# EasyEDA Pro project sch.epro

# Schematic ESCSTRACk

## Sheets
1 Gate_driver: Board Name: Board1; Create Date: 2026-04-11; Page Name: Gate_driver; Project Name: ESC_STACK; Schematic Name: Schematic1; Update Date: 2026-04-11; Company: EasyEDA.com; Page Size: A4; Version: V1.0
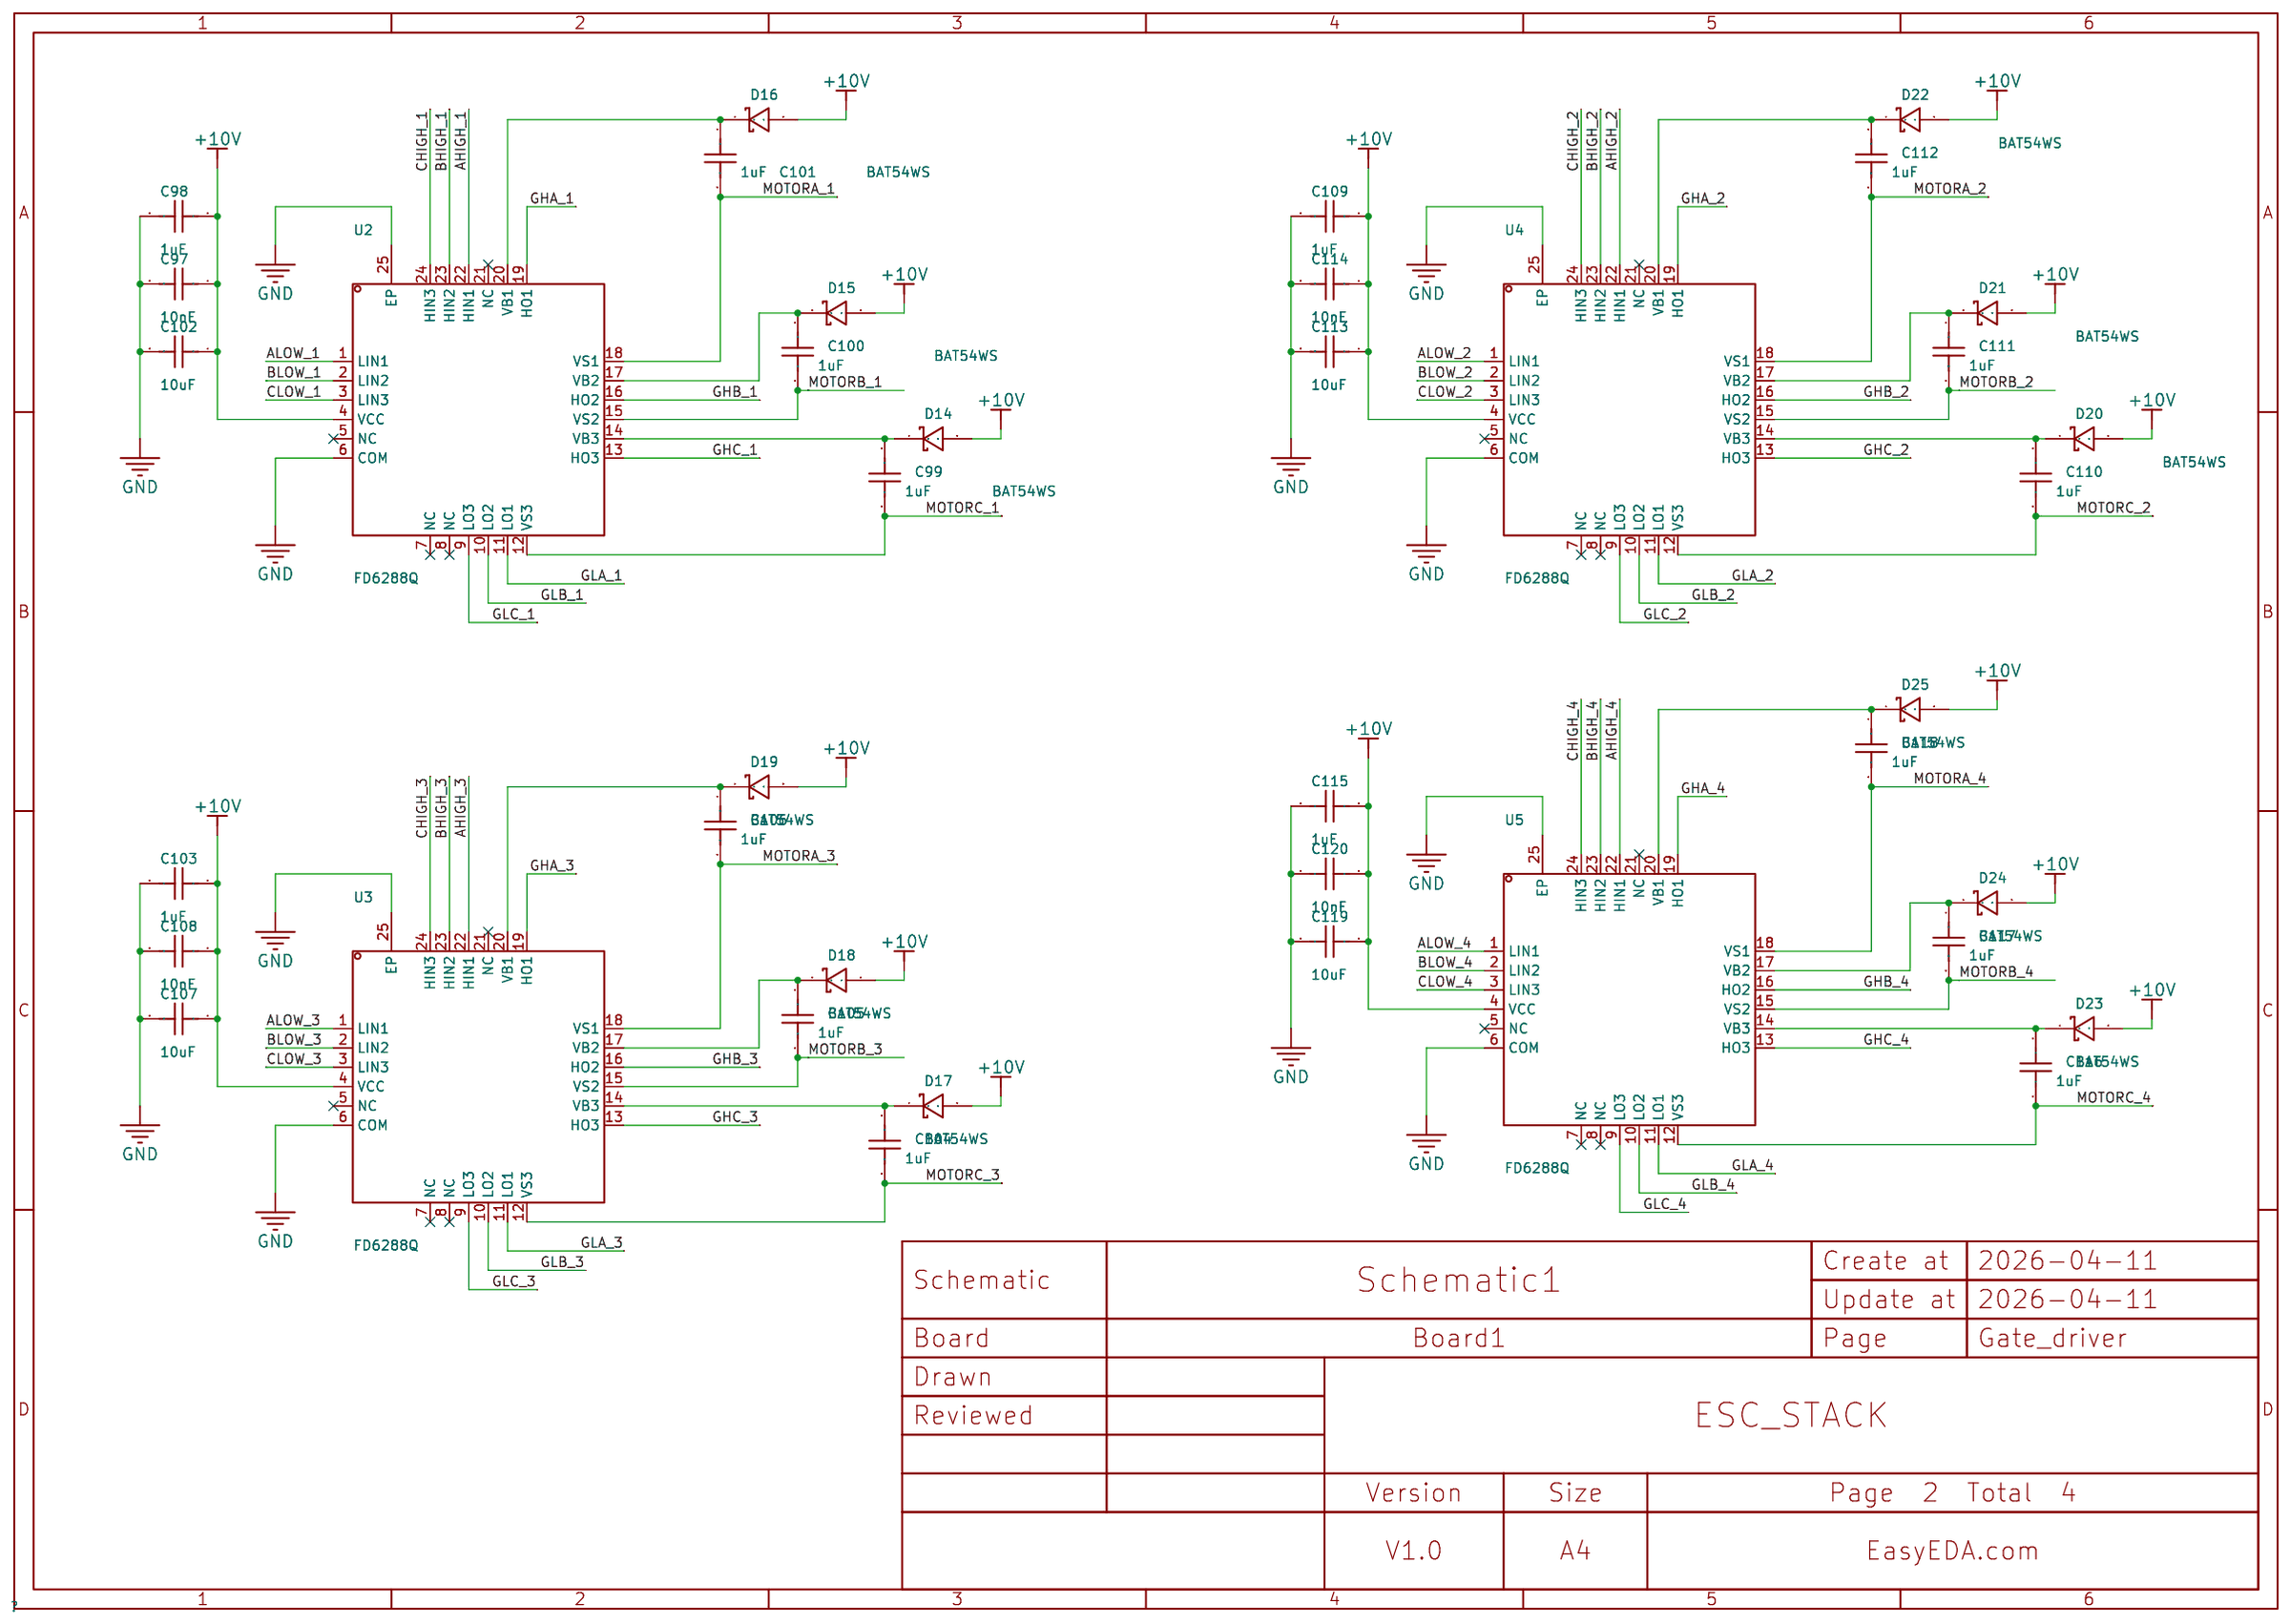
[diagram p0: Gate_driver]
2 MOSFETS: Board Name: ESCSTRACk; Create Date: 2026-05-31; Page Name: MOSFETS; Project Name: ADV_FC; Schematic Name: ESCSTRACk; Update Date: 2026-05-31
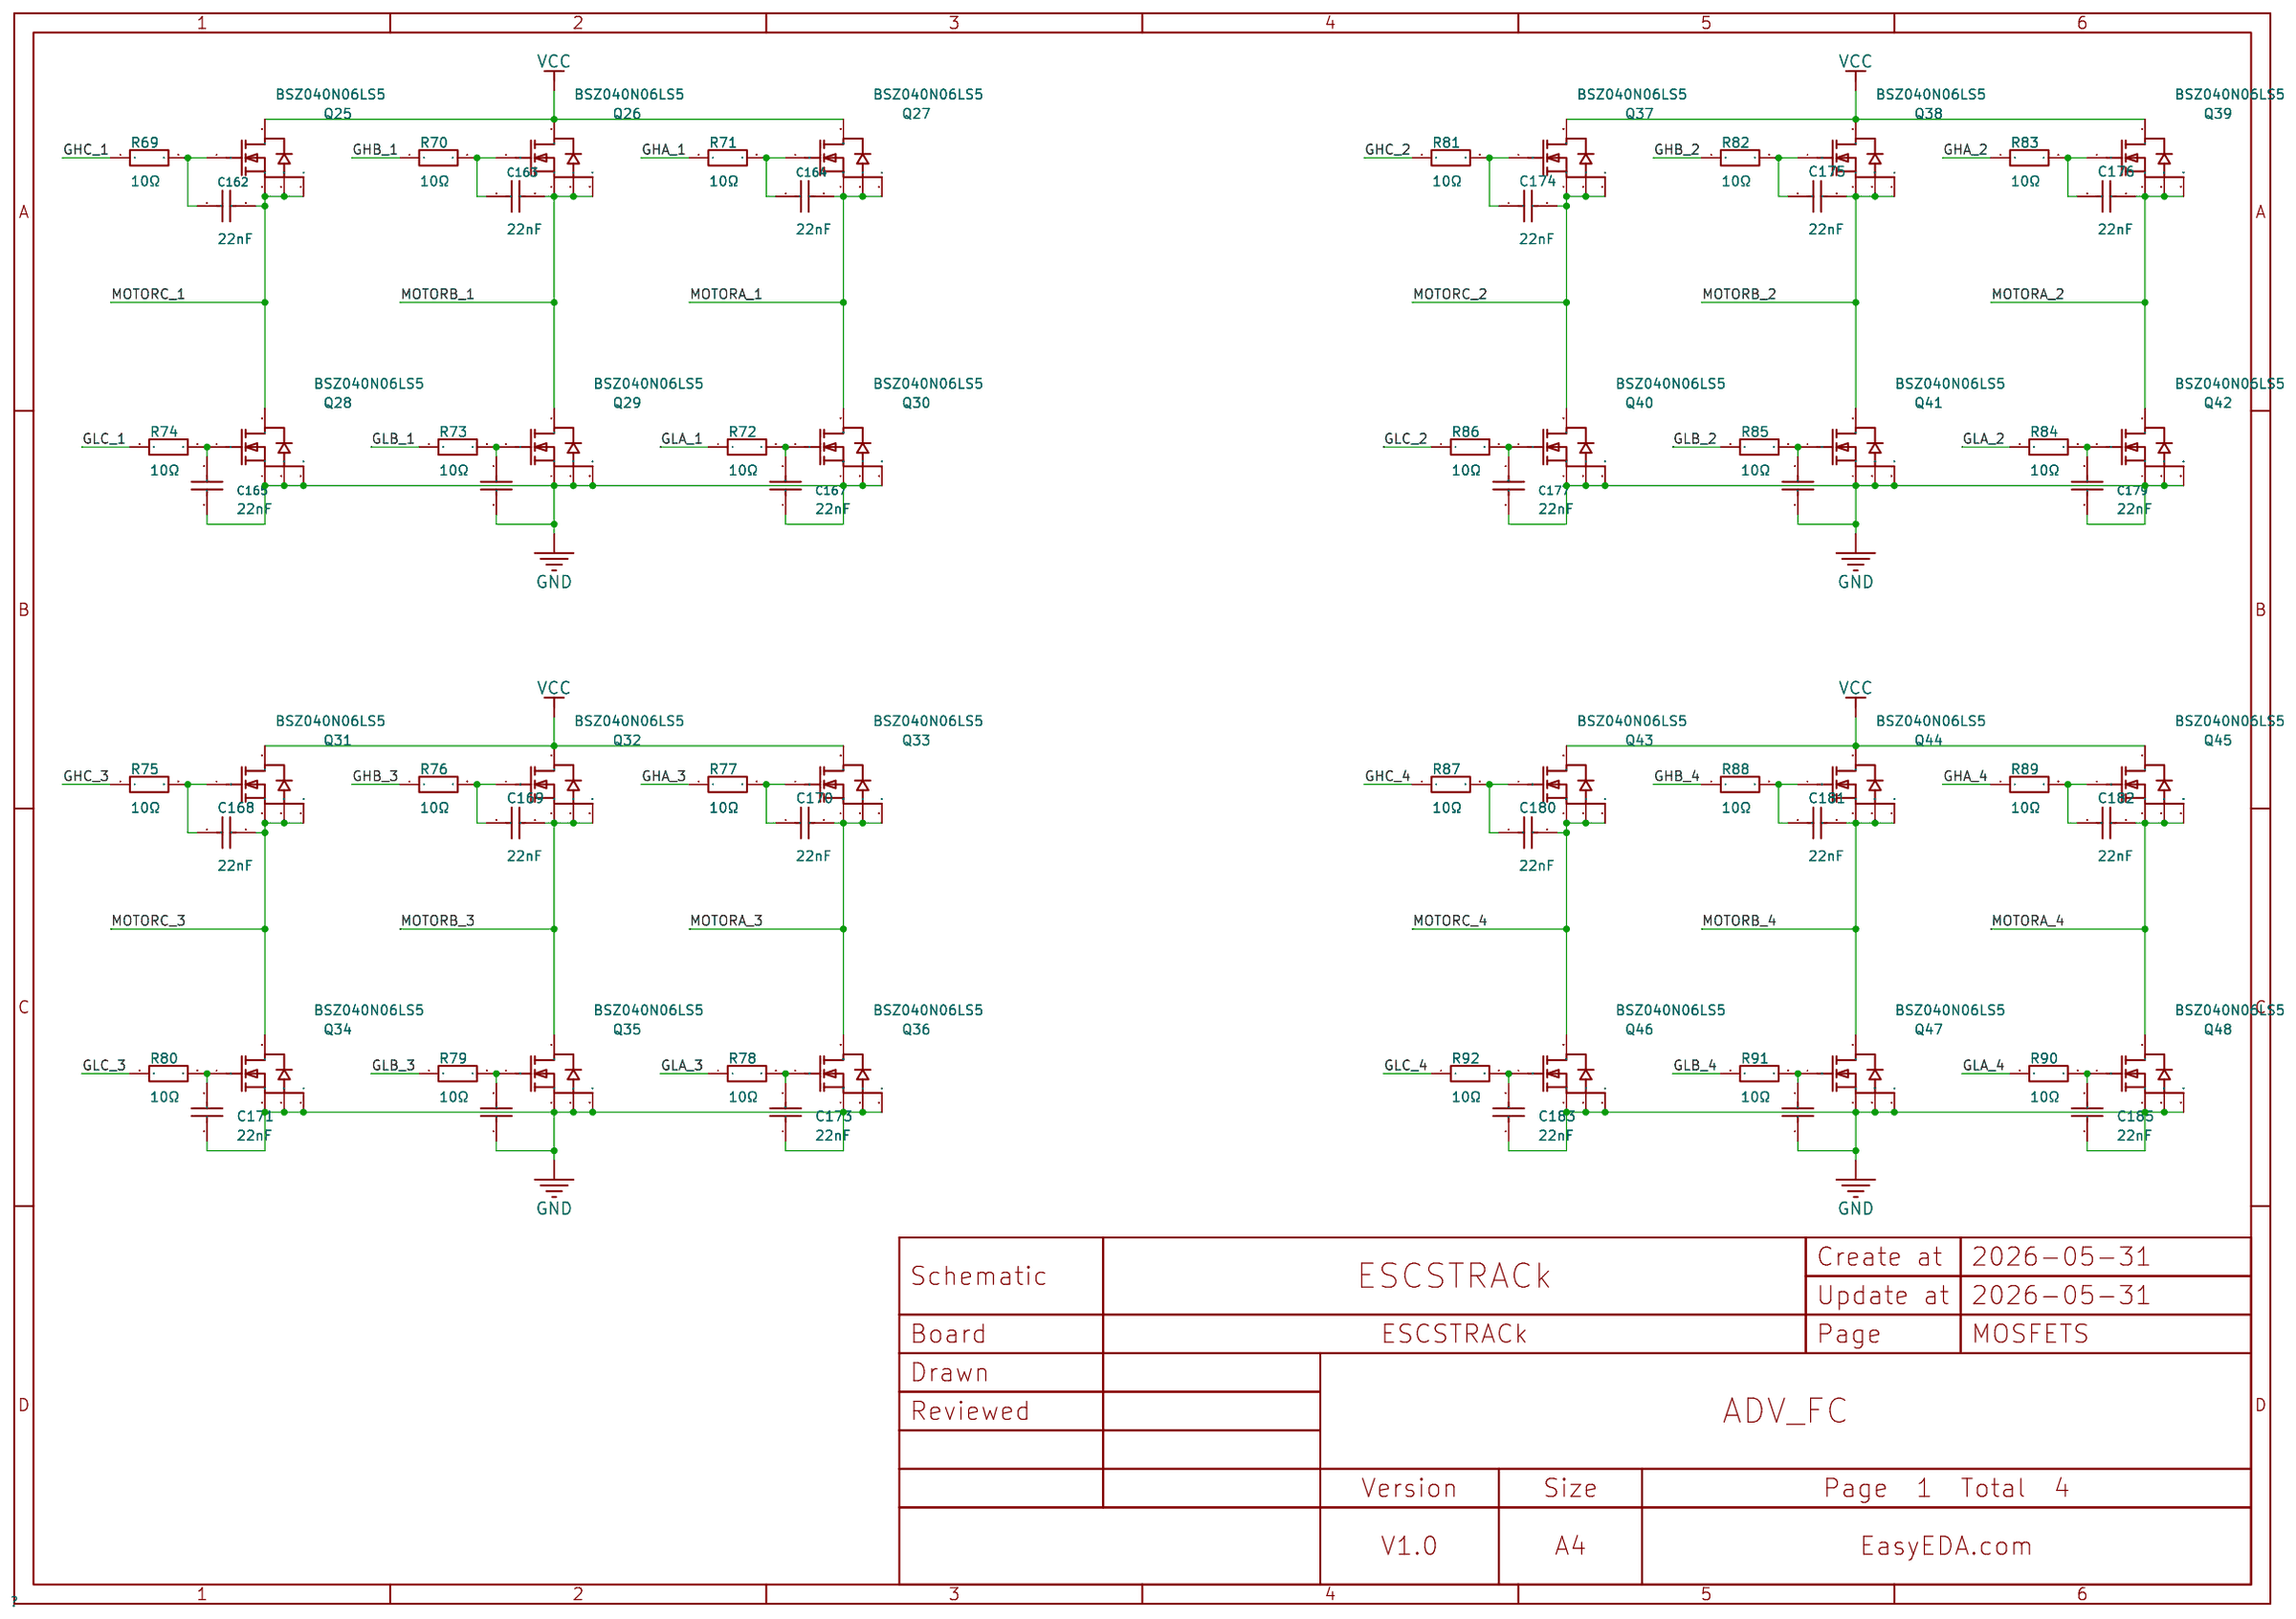
[diagram p1: MOSFETS]
3 POWER & PROCESS: Board Name: ESCSTRACk; Create Date: 2026-05-31; Page Name: POWER & PROCESS; Project Name: ADV_FC; Schematic Name: ESCSTRACk; Update Date: 2026-05-31
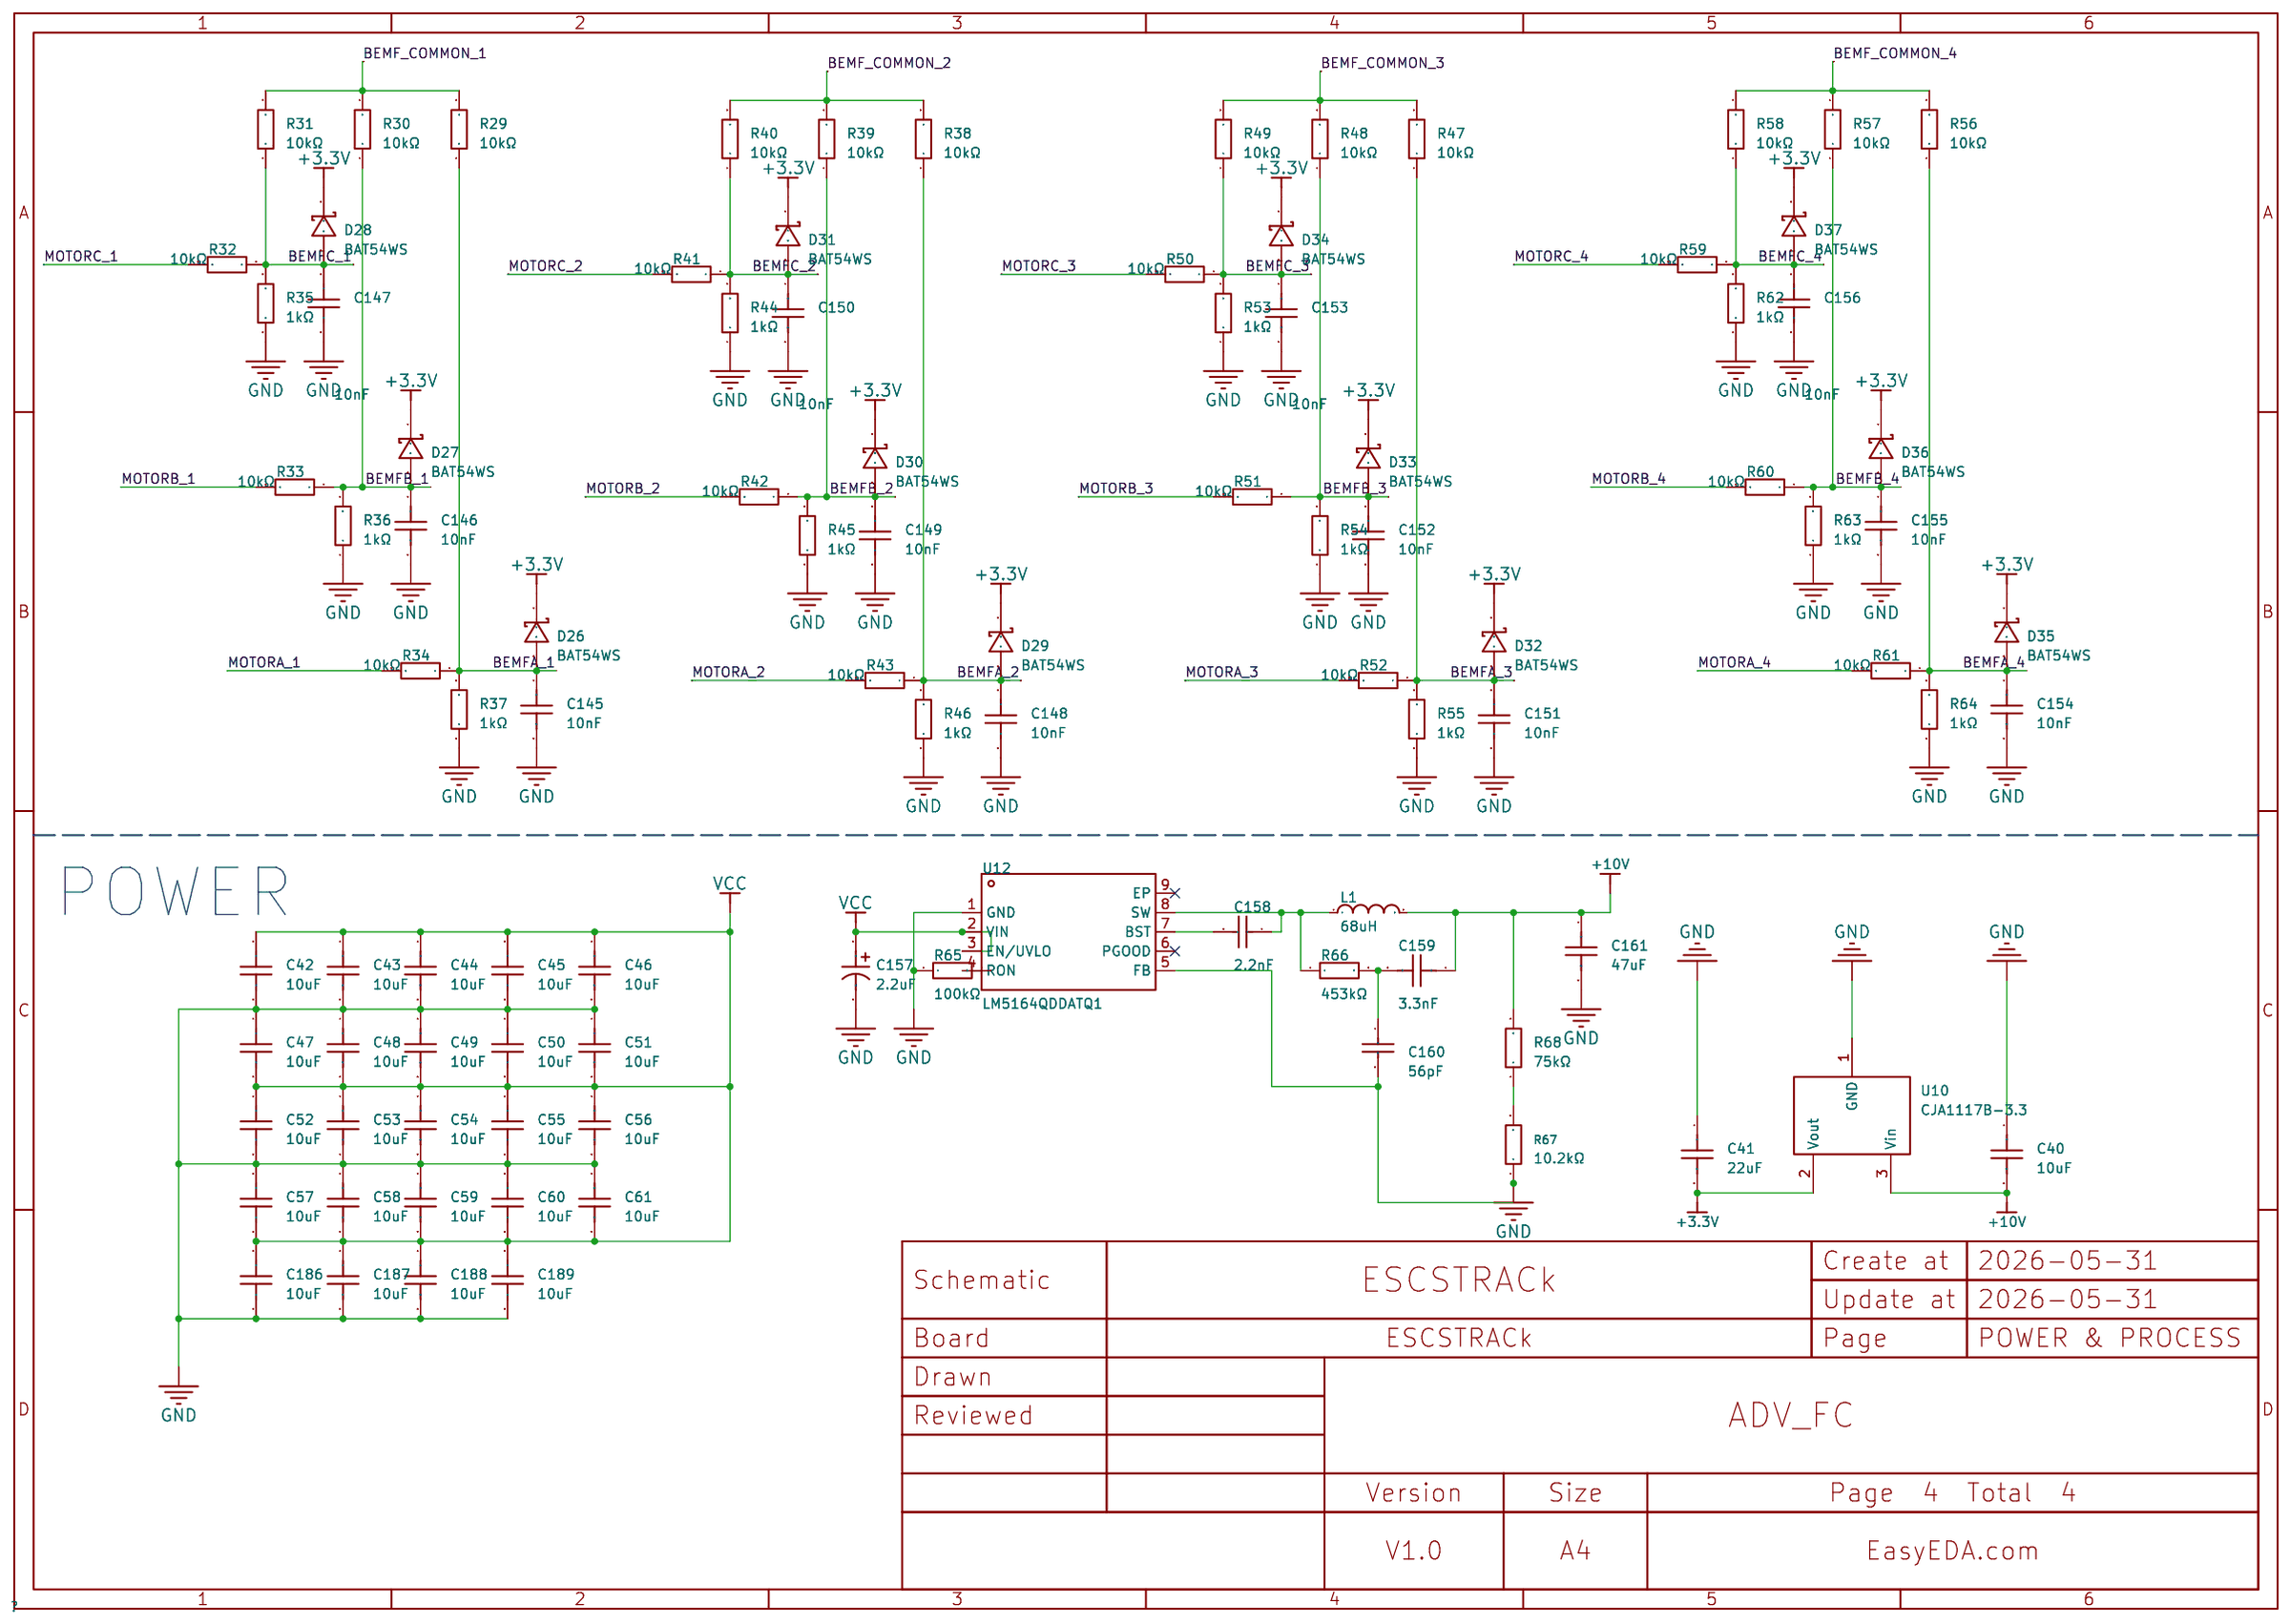
[diagram p2: POWER & PROCESS]
4 MCUs: Page Name: MCUs
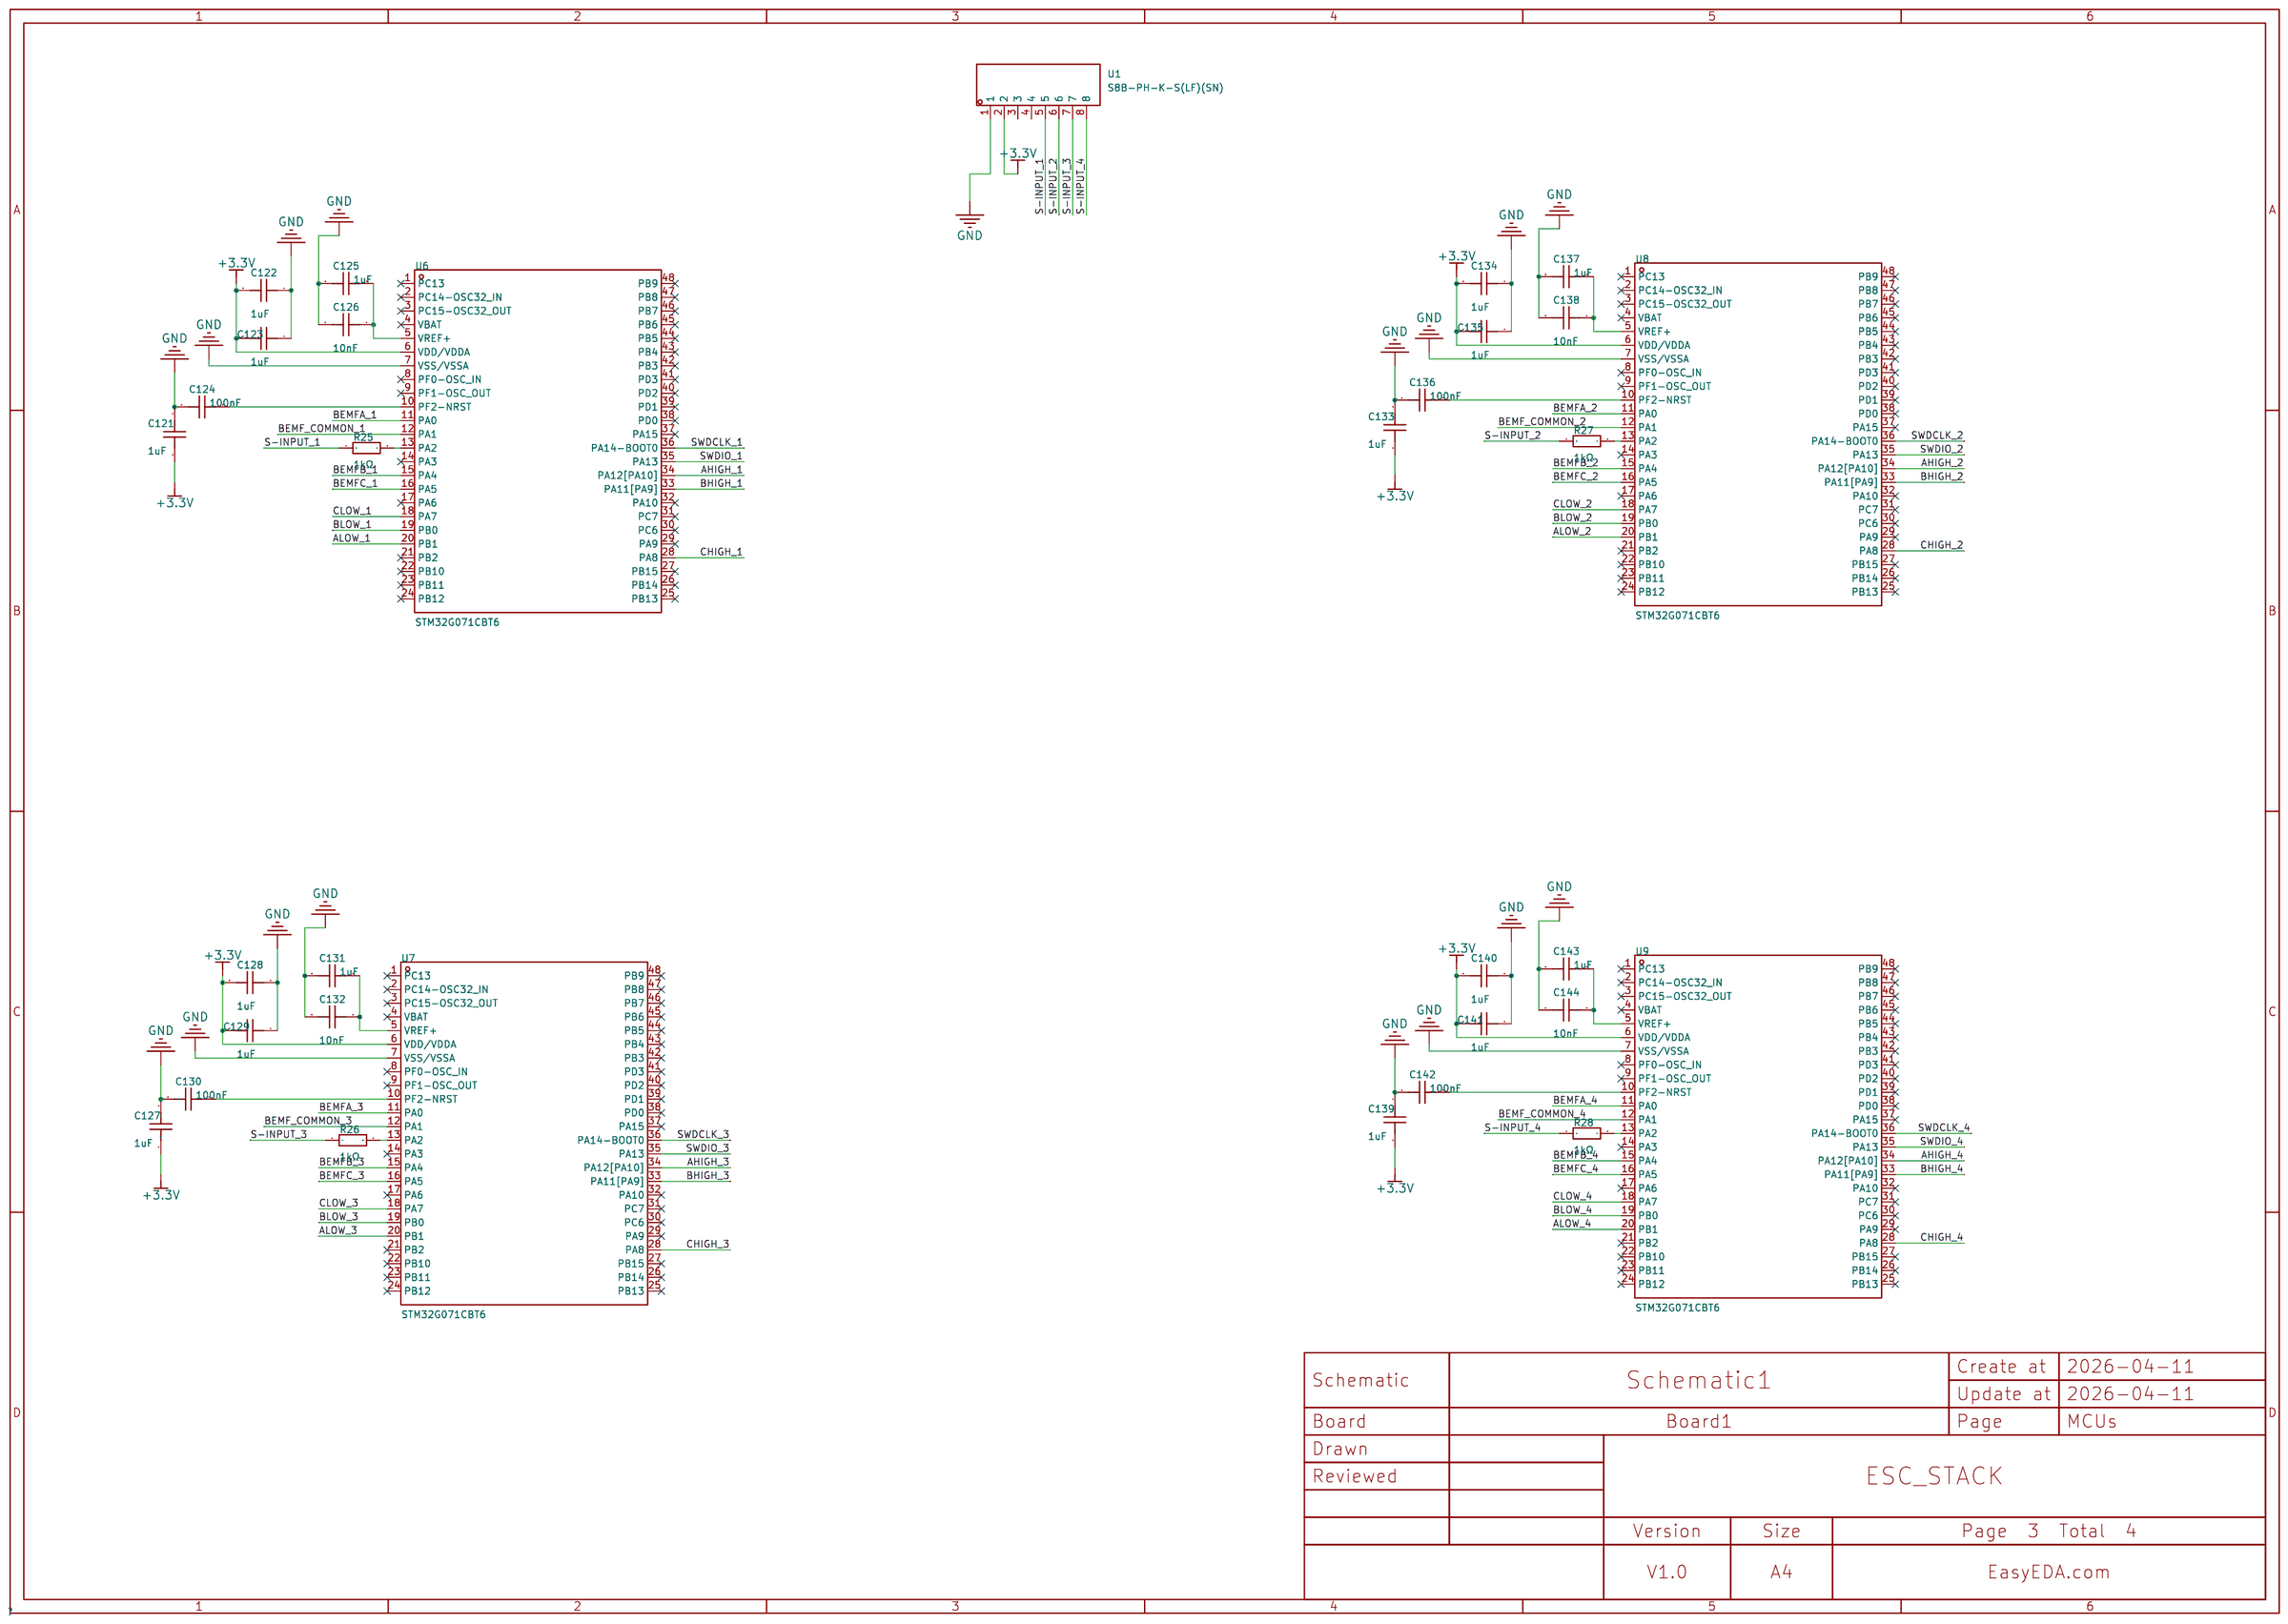
[diagram p3: MCUs]

## Parts
sheet Gate_driver
C97  10nF  [C0402]
C98  1uF  [C0402]
C99  1uF  [C0402]
C100  1uF  [C0402]
C101  1uF  [C0402]
C102  10uF  [C1206]
C103  1uF  [C0402]
C104  1uF  [C0402]
C105  1uF  [C0402]
C106  1uF  [C0402]
C107  10uF  [C1206]
C108  10nF  [C0402]
C109  1uF  [C0402]
C110  1uF  [C0402]
C111  1uF  [C0402]
C112  1uF  [C0402]
C113  10uF  [C1206]
C114  10nF  [C0402]
C115  1uF  [C0402]
C116  1uF  [C0402]
C117  1uF  [C0402]
C118  1uF  [C0402]
C119  10uF  [C1206]
C120  10nF  [C0402]
D14  BAT54WS  [SOD-323_L1.7-W1.3-LS2.6-RD-1]
D15  BAT54WS  [SOD-323_L1.7-W1.3-LS2.6-RD-1]
D16  BAT54WS  [SOD-323_L1.7-W1.3-LS2.6-RD-1]
D17  BAT54WS  [SOD-323_L1.7-W1.3-LS2.6-RD-1]
D18  BAT54WS  [SOD-323_L1.7-W1.3-LS2.6-RD-1]
D19  BAT54WS  [SOD-323_L1.7-W1.3-LS2.6-RD-1]
D20  BAT54WS  [SOD-323_L1.7-W1.3-LS2.6-RD-1]
D21  BAT54WS  [SOD-323_L1.7-W1.3-LS2.6-RD-1]
D22  BAT54WS  [SOD-323_L1.7-W1.3-LS2.6-RD-1]
D23  BAT54WS  [SOD-323_L1.7-W1.3-LS2.6-RD-1]
D24  BAT54WS  [SOD-323_L1.7-W1.3-LS2.6-RD-1]
D25  BAT54WS  [SOD-323_L1.7-W1.3-LS2.6-RD-1]
U2  FD6288Q  [QFN-24_L4.0-W4.0-P0.50-BL-EP2.6]
U3  FD6288Q  [QFN-24_L4.0-W4.0-P0.50-BL-EP2.6]
U4  FD6288Q  [QFN-24_L4.0-W4.0-P0.50-BL-EP2.6]
U5  FD6288Q  [QFN-24_L4.0-W4.0-P0.50-BL-EP2.6]
sheet MCUs
C121  1uF  [C0402]
C122  1uF  [C0402]
C123  1uF  [C0402]
C124  100nF  [C0402]
C125  1uF  [C0603]
C126  10nF  [C0402]
C127  1uF  [C0402]
C128  1uF  [C0402]
C129  1uF  [C0402]
C130  100nF  [C0402]
C131  1uF  [C0603]
C132  10nF  [C0402]
C133  1uF  [C0402]
C134  1uF  [C0402]
C135  1uF  [C0402]
C136  100nF  [C0402]
C137  1uF  [C0603]
C138  10nF  [C0402]
C139  1uF  [C0402]
C140  1uF  [C0402]
C141  1uF  [C0402]
C142  100nF  [C0402]
C143  1uF  [C0603]
C144  10nF  [C0402]
R25  1kΩ  [R0402]
R26  1kΩ  [R0402]
R27  1kΩ  [R0402]
R28  1kΩ  [R0402]
U1  S8B-PH-K-S(LF)(SN)  [CONN-TH_S8B-PH-K-S-LF-SN]
U6  STM32G071CBT6  [LQFP-48_L7.0-W7.0-P0.50-LS9.0-BL]
U7  STM32G071CBT6  [LQFP-48_L7.0-W7.0-P0.50-LS9.0-BL]
U8  STM32G071CBT6  [LQFP-48_L7.0-W7.0-P0.50-LS9.0-BL]
U9  STM32G071CBT6  [LQFP-48_L7.0-W7.0-P0.50-LS9.0-BL]
sheet MOSFETS
C162  22nF  [C0603]
C163  22nF  [C0603]
C164  22nF  [C0603]
C165  22nF  [C0603]
C166  22nF  [C0603]
C167  22nF  [C0603]
C168  22nF  [C0603]
C169  22nF  [C0603]
C170  22nF  [C0603]
C171  22nF  [C0603]
C172  22nF  [C0603]
C173  22nF  [C0603]
C174  22nF  [C0603]
C175  22nF  [C0603]
C176  22nF  [C0603]
C177  22nF  [C0603]
C178  22nF  [C0603]
C179  22nF  [C0603]
C180  22nF  [C0603]
C181  22nF  [C0603]
C182  22nF  [C0603]
C183  22nF  [C0603]
C184  22nF  [C0603]
C185  22nF  [C0603]
Q25  BSZ040N06LS5  [DFN-8_L3.3-W3.3-P0.65-BL-2]
Q26  BSZ040N06LS5  [DFN-8_L3.3-W3.3-P0.65-BL-2]
Q27  BSZ040N06LS5  [DFN-8_L3.3-W3.3-P0.65-BL-2]
Q28  BSZ040N06LS5  [DFN-8_L3.3-W3.3-P0.65-BL-2]
Q29  BSZ040N06LS5  [DFN-8_L3.3-W3.3-P0.65-BL-2]
Q30  BSZ040N06LS5  [DFN-8_L3.3-W3.3-P0.65-BL-2]
Q31  BSZ040N06LS5  [DFN-8_L3.3-W3.3-P0.65-BL-2]
Q32  BSZ040N06LS5  [DFN-8_L3.3-W3.3-P0.65-BL-2]
Q33  BSZ040N06LS5  [DFN-8_L3.3-W3.3-P0.65-BL-2]
Q34  BSZ040N06LS5  [DFN-8_L3.3-W3.3-P0.65-BL-2]
Q35  BSZ040N06LS5  [DFN-8_L3.3-W3.3-P0.65-BL-2]
Q36  BSZ040N06LS5  [DFN-8_L3.3-W3.3-P0.65-BL-2]
Q37  BSZ040N06LS5  [DFN-8_L3.3-W3.3-P0.65-BL-2]
Q38  BSZ040N06LS5  [DFN-8_L3.3-W3.3-P0.65-BL-2]
Q39  BSZ040N06LS5  [DFN-8_L3.3-W3.3-P0.65-BL-2]
Q40  BSZ040N06LS5  [DFN-8_L3.3-W3.3-P0.65-BL-2]
Q41  BSZ040N06LS5  [DFN-8_L3.3-W3.3-P0.65-BL-2]
Q42  BSZ040N06LS5  [DFN-8_L3.3-W3.3-P0.65-BL-2]
Q43  BSZ040N06LS5  [DFN-8_L3.3-W3.3-P0.65-BL-2]
Q44  BSZ040N06LS5  [DFN-8_L3.3-W3.3-P0.65-BL-2]
Q45  BSZ040N06LS5  [DFN-8_L3.3-W3.3-P0.65-BL-2]
Q46  BSZ040N06LS5  [DFN-8_L3.3-W3.3-P0.65-BL-2]
Q47  BSZ040N06LS5  [DFN-8_L3.3-W3.3-P0.65-BL-2]
Q48  BSZ040N06LS5  [DFN-8_L3.3-W3.3-P0.65-BL-2]
R69  10Ω  [R0603]
R70  10Ω  [R0603]
R71  10Ω  [R0603]
R72  10Ω  [R0603]
R73  10Ω  [R0603]
R74  10Ω  [R0603]
R75  10Ω  [R0603]
R76  10Ω  [R0603]
R77  10Ω  [R0603]
R78  10Ω  [R0603]
R79  10Ω  [R0603]
R80  10Ω  [R0603]
R81  10Ω  [R0603]
R82  10Ω  [R0603]
R83  10Ω  [R0603]
R84  10Ω  [R0603]
R85  10Ω  [R0603]
R86  10Ω  [R0603]
R87  10Ω  [R0603]
R88  10Ω  [R0603]
R89  10Ω  [R0603]
R90  10Ω  [R0603]
R91  10Ω  [R0603]
R92  10Ω  [R0603]
sheet POWER & PROCESS
C40  10uF  [C1206]
C41  22uF  [C0402]
C42  10uF  [C1206]
C43  10uF  [C1206]
C44  10uF  [C1206]
C45  10uF  [C1206]
C46  10uF  [C1206]
C47  10uF  [C1206]
C48  10uF  [C1206]
C49  10uF  [C1206]
C50  10uF  [C1206]
C51  10uF  [C1206]
C52  10uF  [C1206]
C53  10uF  [C1206]
C54  10uF  [C1206]
C55  10uF  [C1206]
C56  10uF  [C1206]
C57  10uF  [C1206]
C58  10uF  [C1206]
C59  10uF  [C1206]
C60  10uF  [C1206]
C61  10uF  [C1206]
C145  10nF  [C0402]
C146  10nF  [C0402]
C147  10nF  [C0402]
C148  10nF  [C0402]
C149  10nF  [C0402]
C150  10nF  [C0402]
C151  10nF  [C0402]
C152  10nF  [C0402]
C153  10nF  [C0402]
C154  10nF  [C0402]
C155  10nF  [C0402]
C156  10nF  [C0402]
C157  2.2uF  [CAP-SMD_BD4.0-L4.3-W4.3-FD]
C158  2.2nF  [C0402]
C159  3.3nF  [C0402]
C160  56pF  [C0603]
C161  47uF  [C1206]
C186  10uF  [C1206]
C187  10uF  [C1206]
C188  10uF  [C1206]
C189  10uF  [C1206]
D26  BAT54WS  [SOD-323_L1.7-W1.3-LS2.6-RD-1]
D27  BAT54WS  [SOD-323_L1.7-W1.3-LS2.6-RD-1]
D28  BAT54WS  [SOD-323_L1.7-W1.3-LS2.6-RD-1]
D29  BAT54WS  [SOD-323_L1.7-W1.3-LS2.6-RD-1]
D30  BAT54WS  [SOD-323_L1.7-W1.3-LS2.6-RD-1]
D31  BAT54WS  [SOD-323_L1.7-W1.3-LS2.6-RD-1]
D32  BAT54WS  [SOD-323_L1.7-W1.3-LS2.6-RD-1]
D33  BAT54WS  [SOD-323_L1.7-W1.3-LS2.6-RD-1]
D34  BAT54WS  [SOD-323_L1.7-W1.3-LS2.6-RD-1]
D35  BAT54WS  [SOD-323_L1.7-W1.3-LS2.6-RD-1]
D36  BAT54WS  [SOD-323_L1.7-W1.3-LS2.6-RD-1]
D37  BAT54WS  [SOD-323_L1.7-W1.3-LS2.6-RD-1]
L1  68uH  [IND-SMD_L7.8-W7.0_SUMIDA_CD73]
R29  10kΩ  [R0402]
R30  10kΩ  [R0402]
R31  10kΩ  [R0402]
R32  10kΩ  [R0402]
R33  10kΩ  [R0402]
R34  10kΩ  [R0402]
R35  1kΩ  [R0402]
R36  1kΩ  [R0402]
R37  1kΩ  [R0402]
R38  10kΩ  [R0402]
R39  10kΩ  [R0402]
R40  10kΩ  [R0402]
R41  10kΩ  [R0402]
R42  10kΩ  [R0402]
R43  10kΩ  [R0402]
R44  1kΩ  [R0402]
R45  1kΩ  [R0402]
R46  1kΩ  [R0402]
R47  10kΩ  [R0402]
R48  10kΩ  [R0402]
R49  10kΩ  [R0402]
R50  10kΩ  [R0402]
R51  10kΩ  [R0402]
R52  10kΩ  [R0402]
R53  1kΩ  [R0402]
R54  1kΩ  [R0402]
R55  1kΩ  [R0402]
R56  10kΩ  [R0402]
R57  10kΩ  [R0402]
R58  10kΩ  [R0402]
R59  10kΩ  [R0402]
R60  10kΩ  [R0402]
R61  10kΩ  [R0402]
R62  1kΩ  [R0402]
R63  1kΩ  [R0402]
R64  1kΩ  [R0402]
R65  100kΩ  [R0603]
R66  453kΩ  [R0402]
R67  10.2kΩ  [R0603]
R68  75kΩ  [R0603]
U10  CJA1117B-3.3  [SOT-89-3_L4.5-W2.5-P1.50-LS4.2-BR]
U12  LM5164QDDATQ1  [SOIC-8_L4.9-W3.9-P1.27-LS6.0-BL-EP2.9]

## Library data of the parts
C97 C108 C114 C120 C126 C132 C138 C144-C156 = CC0402KRX7R9BB103: Capacitance:10nF Tolerance:±10% Tolerance:±10% Voltage Rating:50V Temperature Coefficient:X7R; LCSC Part Name: 10nF ±10% 50V; Supplier Part: C60133; Manufacturer: YAGEO(国巨); Supplier Footprint: 0402; JLCPCB Part Class: Extended Part; Datasheet: https://item.szlcsc.com/datasheet/CC0402KRX7R9BB103/61185.html; Supplier: LCSC; Tolerance: ±10%; Voltage Rating: 50V; Temperature Coefficient: X7R
C98-C101 C103-C106 C109-C112 C115-C118 C121-C123 C127-C129 C133-C135 C139-C141 = CL05A105KA5NQNC: Capacitance:1uF Tolerance:±10% Tolerance:±10% Voltage Rating:25V Temperature Coefficient:X5R; LCSC Part Name: 1uF ±10% 25V; Supplier Part: C52923; Manufacturer: SAMSUNG(三星); Supplier Footprint: 0402; JLCPCB Part Class: Basic Part; Datasheet: https://item.szlcsc.com/datasheet/CL05A105KA5NQNC/53938.html; Supplier: LCSC; Tolerance: ±10%; Voltage Rating: 25V; Temperature Coefficient: X5R
C40 C42-C61 C102 C107 C113 C119 C186-C189 = CL31A106KBHNNNE: Capacitance:10uF Tolerance:±10% Tolerance:±10% Voltage Rating:50V Temperature Coefficient:X5R; LCSC Part Name: 10uF ±10% 50V; Supplier Part: C13585; Manufacturer: SAMSUNG(三星); Supplier Footprint: 1206; JLCPCB Part Class: Basic Part; Datasheet: https://item.szlcsc.com/datasheet/CL31A106KBHNNNE/14236.html; Supplier: LCSC; Tolerance: ±10%; Voltage Rating: 50V; Temperature Coefficient: X5R
D14-D37 = BAT54WS_C466657: Voltage - Forward(Vf@If):1V@100mA Voltage - DC Reverse(Vr):30V Current - Rectified:100mA Reverse Leakage Current (Ir):2uA@25V Non-Repetitive Peak Forward Surge Current:600mA; LCSC Part Name: 电压:30V 电流:100mA; Supplier Part: C466657; Manufacturer: High Diode(海德); Supplier Footprint: SOD-323; JLCPCB Part Class: Extended Part; Datasheet: https://item.szlcsc.com/datasheet/BAT54WS/471785.html; Supplier: LCSC; Voltage - Forward(Vf@If): 1V@100mA; Voltage - DC Reverse(Vr): 30V; Current - Rectified: 100mA; Reverse Leakage Current (Ir): 2uA@25V; Non-Repetitive Peak Forward Surge Current: 600mA
U2-U5 = FD6288Q_C328453: Driven Configuration:Three Phase Load Type:MOSFET；IGBT Number of Drivers:3 Current - Output Low(IOL):1.8A Current - Output High(IOH):1.5A Voltage - Supply:5V~20V Voltage - Supply:5V~20V Rise Time:12ns Fall Time:12ns Propagation Delay tpLH:300ns Propagatio; LCSC Part Name: 三相250V栅极驱动器; Supplier Part: C328453; Manufacturer: Fortior Tech(峰岹); Supplier Footprint: QFN-24-EP(4x4); JLCPCB Part Class: Extended Part; Datasheet: https://item.szlcsc.com/datasheet/FD6288Q/308367.html; Supplier: LCSC; Driven Configuration: Three Phase; Load Type: MOSFET；IGBT; Number of Drivers: 3; Current - Output Low(IOL): 1.8A; Current - Output High(IOH): 1.5A; Voltage - Supply: 5V~20V; Rise Time: 12ns; Fall Time: 12ns; Propagation Delay tpLH: 300ns; Propagation Delay tpHL: 100ns; Features: Under Voltage Protection; Operating Temperature: -40℃~+125℃; Input Logic Level - High: 2.7V; Input Logic Level - Low: 800mV; Quiescent Current(Iq): 330uA
C124 C130 C136 C142 = CL05B104KO5NNNC: Capacitance:100nF Tolerance:±10% Tolerance:±10% Voltage Rating:16V Temperature Coefficient:X7R; LCSC Part Name: 100nF ±10% 16V; Supplier Part: C1525; Manufacturer: SAMSUNG(三星); Supplier Footprint: 0402; JLCPCB Part Class: Basic Part; Datasheet: https://item.szlcsc.com/datasheet/CL05B104KO5NNNC/1877.html; Supplier: LCSC; Tolerance: ±10%; Voltage Rating: 16V; Temperature Coefficient: X7R
C125 C131 C137 C143 = CL10A105KB8NNNC: Capacitance:1uF Tolerance:±10% Tolerance:±10% Voltage Rating:50V Temperature Coefficient:X5R; LCSC Part Name: 1uF ±10% 50V; Supplier Part: C15849; Manufacturer: SAMSUNG(三星); Supplier Footprint: 0603; JLCPCB Part Class: Basic Part; Datasheet: https://item.szlcsc.com/datasheet/CL10A105KB8NNNC/16531.html; Supplier: LCSC; Tolerance: ±10%; Voltage Rating: 50V; Temperature Coefficient: X5R
R25-R28 R35-R37 R44-R46 R53-R55 R62-R64 = 0402WGF1001TCE: Type:Thick Film Resistor Resistance:1kΩ Tolerance:±1% Tolerance:±1% Power(Watts):62.5mW Voltage-Supply(Max):50V Temperature Coefficient:±100ppm/℃ Temperature Coefficient:±100ppm/℃ Operating Temperature:-55℃~+155℃ Operating Temperature:-55℃~+155℃; LCSC Part Name: 1kΩ ±1% 62.5mW 厚膜电阻; Supplier Part: C11702; Manufacturer: UNI-ROYAL(厚声); Supplier Footprint: 0402; JLCPCB Part Class: Basic Part; Datasheet: https://item.szlcsc.com/datasheet/0402WGF1001TCE/12256.html; Supplier: LCSC; Type: Thick Film Resistor; Tolerance: ±1%; Power(Watts): 62.5mW; Voltage-Supply(Max): 50V; Temperature Coefficient: ±100ppm/℃; Operating Temperature: -55℃~+155℃
U1 = S8B-PH-K-S(LF)(SN): Pins Structure:1x8P Pitch:2mm Mounting Type:Right Angle Reference Series:PH Number of Pins:8P Number of Rows:1 Number of PINs Per Row:8 Row Spacing:- Current Rating:2A Contact Material:Brass Contact Plating:Tin Operating Temperature:-25℃~+85℃ Operating Te; LCSC Part Name: 1x8P 间距:2mm 弯插 系列:PH; Supplier Part: C157915; Manufacturer: JST; Supplier Footprint: 弯插,P=2mm; JLCPCB Part Class: Extended Part; Datasheet: https://item.szlcsc.com/datasheet/S8B-PH-K-S(LF)(SN)/169263.html; Supplier: LCSC; Pins Structure: 1x8P; Pitch: 2mm; Mounting Type: Right Angle; Reference Series: PH; Number of Pins: 8P; Number of Rows: 1; Number of PINs Per Row: 8; Current Rating: 2A; Contact Material: Brass; Contact Plating: Tin; Operating Temperature: -25℃~+85℃; Voltage Rating: 100V; Plastic Material: PA66; Flame Retardant Rating: UL94V-0; Supplementary Features: K Pin; Color: White; Z-Height of the Board: 4.8mm; X-Length of Bottom Edge on Board (Spacing Line): 17.9mm; Y-Width of Bottom Edge on Board: 7.6mm
U6-U9 = STM32G071CBT6: CPU Core:ARM-M0+ CPU Maximum Speed:64MHz Program Storage Size:128KB Program Memory Type:FLASH Number of I/O:44 ADC (Bit):12bit DAC (Bit):12bit Voltage - Supply:1.71V~3.6V Voltage - Supply:1.71V~3.6V Applications:-; LCSC Part Name: 主流Arm Cortex-M0+ MCU，具有128 KB Flash存储器、36 KB RAM、64 MHz CPU、4x USART、定时器、ADC、DAC和通信接口，1.7-3.6V; Supplier Part: C432212; Manufacturer: ST(意法半导体); Supplier Footprint: LQFP-48(7x7); JLCPCB Part Class: Extended Part; Datasheet: https://item.szlcsc.com/datasheet/STM32G071CBT6/429000.html; Supplier: LCSC; CPU Core: ARM-M0+; CPU Maximum Speed: 64MHz; Program Storage Size: 128KB; Program Memory Type: FLASH; Number of I/O: 44; ADC (Bit): 12bit; DAC (Bit): 12bit; Voltage - Supply: 1.71V~3.6V
C162-C185 = CL10B223KB8NNNC: Capacitance:22nF Tolerance:±10% Tolerance:±10% Voltage Rating:50V Temperature Coefficient:X7R; LCSC Part Name: 22nF ±10% 50V; Supplier Part: C21122; Manufacturer: SAMSUNG(三星); Supplier Footprint: 0603; JLCPCB Part Class: Basic Part; Datasheet: https://item.szlcsc.com/datasheet/CL10B223KB8NNNC/21834.html; Supplier: LCSC; Tolerance: ±10%; Voltage Rating: 50V; Temperature Coefficient: X7R
Q25-Q48 = BSZ040N06LS5_C3279309: Number:1 N-Channel Drain to Source Voltage:60V Current - Continuous Drain(Id):101A RDS(on):4mΩ@10V Pd - Power Dissipation:69W Gate Threshold Voltage (Vgs(th)):2.3V@36uA Gate Charge(Qg):22nC@4.5V Input Capacitance(Ciss):3.1nF Reverse Transfer Capacitance (; LCSC Part Name: 1个N沟道 耐压:60V 电流:101A; Supplier Part: C3279309; Manufacturer: Infineon(英飞凌); Supplier Footprint: TSDSON-8; JLCPCB Part Class: Extended Part; Datasheet: https://item.szlcsc.com/datasheet/BSZ040N06LS5/3842207.html; Supplier: LCSC; Number: 1 N-Channel; Drain to Source Voltage: 60V; Current - Continuous Drain(Id): 101A; RDS(on): 4mΩ@10V; Pd - Power Dissipation: 69W; Gate Threshold Voltage (Vgs(th)): 2.3V@36uA; Gate Charge(Qg): 22nC@4.5V; Input Capacitance(Ciss): 3.1nF; Reverse Transfer Capacitance (Crss@Vds): 44pF; Operating Temperature: -55℃~+150℃; Type: N-Channel; Output Capacitance(Coss): 650pF
R69-R92 = RC0603FR-0710RL: Type:Thick Film Resistors Resistance: Tolerance:±1% Tolerance:±1% Power(Watts): Overload Voltage (Max): Temperature Coefficient:±200ppm/℃ Temperature Coefficient:±200ppm/℃ Operating Temperature Range:-55℃~+155℃ Operating Temperature Range:-55℃~+155℃; LCSC Part Name: 厚膜电阻 10Ω ±1% 100mW; Supplier Part: C109318; Manufacturer: YAGEO(国巨); Supplier Footprint: 0603; JLCPCB Part Class: Extended Part; Datasheet: https://atta.szlcsc.com/upload/public/pdf/source/20180316/70C0E2BDAE7FCC62C531A5A58D202EE1.pdf; Supplier: LCSC; Type: Thick Film Resistors; Tolerance: ±1%; Temperature Coefficient: ±200ppm/℃; Operating Temperature Range: -55℃~+155℃
C41 = GRM155R60J226ME11D: Capacitance:22uF Tolerance:±20% Tolerance:±20% Voltage Rating:6.3V Temperature Coefficient:X5R; LCSC Part Name: 22uF ±20% 6.3V; Supplier Part: C415703; Manufacturer: muRata(村田); Supplier Footprint: 0402; JLCPCB Part Class: Extended Part; Datasheet: https://item.szlcsc.com/datasheet/GRM155R60J226ME11D/408393.html; Supplier: LCSC; Tolerance: ±20%; Voltage Rating: 6.3V; Temperature Coefficient: X5R
C157 = RVT1H2R2M0405 2.2UF 50V: Capacitance:2.2uF Tolerance:±20% Tolerance:±20% Voltage Rating:50V Ripple Current:12mA@120Hz Equivalent Series Resistance(ESR):- Diameter:4mm Height - Seated (Max):5.4mm Lifetime:2800hrs@105℃ Operating Temperature:-55℃~+105℃ Operating Temperature:-55℃~+10; LCSC Part Name: 2.2uF ±20% 50V; Supplier Part: C970595; Manufacturer: DMBJ(振宝佳); Supplier Footprint: SMD,D4xL5.4mm; JLCPCB Part Class: Extended Part; Datasheet: https://item.szlcsc.com/datasheet/RVT1H2R2M0405%25202.2UF%252050V/1060373.html; Supplier: LCSC; Tolerance: ±20%; Voltage Rating: 50V; Ripple Current: 12mA@120Hz; Diameter: 4mm; Height - Seated (Max): 5.4mm; Lifetime: 2800hrs@105℃; Operating Temperature: -55℃~+105℃
C158 = 0402B222K500NT: Capacitance:2.2nF Tolerance:±10% Tolerance:±10% Voltage Rating:50V Temperature Coefficient:X7R; LCSC Part Name: 2.2nF ±10% 50V; Supplier Part: C1531; Manufacturer: FH(风华); Supplier Footprint: 0402; JLCPCB Part Class: Extended Part; Datasheet: https://item.szlcsc.com/datasheet/0402B222K500NT/1883.html; Supplier: LCSC; Tolerance: ±10%; Voltage Rating: 50V; Temperature Coefficient: X7R
C159 = TCC0402X7R332K500AT: Capacitance:3.3nF Tolerance:±10% Tolerance:±10% Voltage Rating:50V Temperature Coefficient:X7R; LCSC Part Name: 3.3nF ±10% 50V; Supplier Part: C696855; Manufacturer: CCTC(三环); Supplier Footprint: 0402; JLCPCB Part Class: Extended Part; Datasheet: https://item.szlcsc.com/datasheet/TCC0402X7R332K500AT/730939.html; Supplier: LCSC; Tolerance: ±10%; Voltage Rating: 50V; Temperature Coefficient: X7R
C160 = CC0603JRNPO9BN560: Capacitance:56pF Tolerance:±5% Tolerance:±5% Voltage Rating:50V Temperature Coefficient:NP0; LCSC Part Name: 56pF ±5% 50V; Supplier Part: C107053; Manufacturer: YAGEO(国巨); Supplier Footprint: 0603; JLCPCB Part Class: Extended Part; Datasheet: https://item.szlcsc.com/datasheet/CC0603JRNPO9BN560/108269.html; Supplier: LCSC; Tolerance: ±5%; Voltage Rating: 50V; Temperature Coefficient: NP0
C161 = CL31A476MPHNNNE: Capacitance:47uF Tolerance:±20% Tolerance:±20% Voltage Rating:10V Temperature Coefficient:X5R; LCSC Part Name: 47uF ±20% 10V; Supplier Part: C96123; Manufacturer: SAMSUNG(三星); Supplier Footprint: 1206; JLCPCB Part Class: Basic Part; Datasheet: https://item.szlcsc.com/datasheet/CL31A476MPHNNNE/97327.html; Supplier: LCSC; Tolerance: ±20%; Voltage Rating: 10V; Temperature Coefficient: X5R
L1 = CY75-68UH: Inductance:68uH Tolerance:±10% Tolerance:±10% Current Rating:830mA Current - Saturation (Isat):- DC Resistance(DCR):234mΩ Q @ Frequency:- Frequency - Self Resonant:- Ratings:- Type:Drum-core inductor; LCSC Part Name: 68uH ±10%; Supplier Part: C2929442; Manufacturer: SHOU HAN(首韩); Supplier Footprint: SMD,7.8x7mm; JLCPCB Part Class: Extended Part; Datasheet: https://item.szlcsc.com/datasheet/CY75-68UH/3264924.html; Supplier: LCSC; Tolerance: ±10%; Current Rating: 830mA; DC Resistance(DCR): 234mΩ; Type: Drum-core inductor
R29-R34 R38-R43 R47-R52 R56-R61 = 0402WGF1002TCE: Type:Thick Film Resistor Resistance:10kΩ Tolerance:±1% Tolerance:±1% Power(Watts):62.5mW Voltage-Supply(Max):50V Temperature Coefficient:±100ppm/℃ Temperature Coefficient:±100ppm/℃ Operating Temperature:-55℃~+155℃ Operating Temperature:-55℃~+155℃; LCSC Part Name: 10kΩ ±1% 62.5mW 厚膜电阻; Supplier Part: C25744; Manufacturer: UNI-ROYAL(厚声); Supplier Footprint: 0402; JLCPCB Part Class: Basic Part; Datasheet: https://item.szlcsc.com/datasheet/0402WGF1002TCE/26487.html; Supplier: LCSC; Type: Thick Film Resistor; Tolerance: ±1%; Power(Watts): 62.5mW; Voltage-Supply(Max): 50V; Temperature Coefficient: ±100ppm/℃; Operating Temperature: -55℃~+155℃
R65 = 0603WAF1003T5E: Type:Thick Film Resistor Resistance:100kΩ Tolerance:±1% Tolerance:±1% Power(Watts):100mW Voltage-Supply(Max):75V Temperature Coefficient:±100ppm/℃ Temperature Coefficient:±100ppm/℃ Operating Temperature:-55℃~+155℃ Operating Temperature:-55℃~+155℃; LCSC Part Name: 100kΩ ±1% 100mW 厚膜电阻; Supplier Part: C25803; Manufacturer: UNI-ROYAL(厚声); Supplier Footprint: 0603; JLCPCB Part Class: Basic Part; Datasheet: https://item.szlcsc.com/datasheet/0603WAF1003T5E/26546.html; Supplier: LCSC; Type: Thick Film Resistor; Tolerance: ±1%; Power(Watts): 100mW; Voltage-Supply(Max): 75V; Temperature Coefficient: ±100ppm/℃; Operating Temperature: -55℃~+155℃
R66 = 0402WGF4533TCE: Type:Thick Film Resistor Resistance:453kΩ Tolerance:±1% Tolerance:±1% Power(Watts):62.5mW Voltage-Supply(Max):50V Temperature Coefficient:±100ppm/℃ Temperature Coefficient:±100ppm/℃ Operating Temperature:-55℃~+155℃ Operating Temperature:-55℃~+155℃; LCSC Part Name: 453kΩ ±1% 62.5mW 厚膜电阻; Supplier Part: C27009; Manufacturer: UNI-ROYAL(厚声); Supplier Footprint: 0402; JLCPCB Part Class: Extended Part; Datasheet: https://item.szlcsc.com/datasheet/0402WGF4533TCE/27758.html; Supplier: LCSC; Type: Thick Film Resistor; Tolerance: ±1%; Power(Watts): 62.5mW; Voltage-Supply(Max): 50V; Temperature Coefficient: ±100ppm/℃; Operating Temperature: -55℃~+155℃
R67 = RMC060310.2K1%N: Type:Thick Film Resistor Resistance:10.2kΩ Tolerance:±1% Tolerance:±1% Power(Watts):100mW Voltage-Supply(Max):50V Temperature Coefficient:±100ppm/℃ Temperature Coefficient:±100ppm/℃ Operating Temperature:-55℃~+155℃ Operating Temperature:-55℃~+155℃; LCSC Part Name: 厚膜电阻 10.2kΩ ±1% 100mW; Supplier Part: C269897; Manufacturer: Tyohm(幸亚电阻); Supplier Footprint: 0603; JLCPCB Part Class: Extended Part; Datasheet: https://item.szlcsc.com/datasheet/RMC060310.2K1%2525N/259479.html; Supplier: LCSC; Type: Thick Film Resistor; Tolerance: ±1%; Power(Watts): 100mW; Voltage-Supply(Max): 50V; Temperature Coefficient: ±100ppm/℃; Operating Temperature: -55℃~+155℃
R68 = 0603WAF7502T5E: Type:Thick Film Resistor Resistance:75kΩ Tolerance:±1% Tolerance:±1% Power(Watts):100mW Voltage-Supply(Max):75V Temperature Coefficient:±100ppm/℃ Temperature Coefficient:±100ppm/℃ Operating Temperature:-55℃~+155℃ Operating Temperature:-55℃~+155℃; LCSC Part Name: 75kΩ ±1% 100mW 厚膜电阻; Supplier Part: C23242; Manufacturer: UNI-ROYAL(厚声); Supplier Footprint: 0603; JLCPCB Part Class: Basic Part; Datasheet: https://item.szlcsc.com/datasheet/0603WAF7502T5E/23969.html; Supplier: LCSC; Type: Thick Film Resistor; Tolerance: ±1%; Power(Watts): 100mW; Voltage-Supply(Max): 75V; Temperature Coefficient: ±100ppm/℃; Operating Temperature: -55℃~+155℃
U10 = CJA1117B-3.3: Output Type:Fixed Voltage - Supply:15V Output Voltage:3.3V Output Voltage:3.3V Output Current:1A Power Supply Rejection Ratio (PSRR):75dB@(120Hz) Voltage Dropout:1.15V@(1A) standby current:5mA Noise:0.003%Vout Features:Over Temperature Protection；Over Cur; LCSC Part Name: 输入15V 输出3.3V 1A; Supplier Part: C24253; Manufacturer: CJ(江苏长电/长晶); Supplier Footprint: SOT-89-3; JLCPCB Part Class: Extended Part; Datasheet: https://item.szlcsc.com/datasheet/CJA1117B-3.3/24993.html; Supplier: LCSC; Output Type: Fixed; Voltage - Supply: 15V; Output Voltage: 3.3V; Output Current: 1A; Power Supply Rejection Ratio (PSRR): 75dB@(120Hz); Voltage Dropout: 1.15V@(1A); standby current: 5mA; Noise: 0.003%Vout; Features: Over Temperature Protection；Over Current Protection; Operating Temperature: -25℃~+125℃@(Tj); Output Configuration: Positive; Number of Outputs: 1
U12 = LM5164QDDATQ1: Function:Step-down type Output Type:- Voltage - Supply:6V~100V Voltage - Supply:6V~100V Output Voltage:- Output Voltage:- Output Current:1A Frequency - Switching:1MHz Frequency - Switching:1MHz Operating Temperature:-40℃~+150℃@(TJ) Operating Temperature:-; Supplier Part: C1850350; Manufacturer: TI(德州仪器); Supplier Footprint: SO-8; JLCPCB Part Class: Extended Part; Datasheet: https://www.ti.com/cn/lit/gpn/lm5164-q1; Supplier: LCSC; Function: Step-down type; Voltage - Supply: 6V~100V; Output Current: 1A; Frequency - Switching: 1MHz; Operating Temperature: -40℃~+150℃@(TJ); Synchronous Rectifier: Yes; Number of Outputs: 1; Topology: Step-down; Switch tube (built-in/external): Built-in

## Nets
+3.3V: C41.2 C121.2 C122.2 C123.2 C127.2 C128.2 C129.2 C133.2 C134.2 C135.2 C139.2 C140.2 C141.2 D26.1 D27.1 D28.1 D29.1 D30.1 D31.1 D32.1 D33.1 D34.1 D35.1 D36.1 D37.1 U1.2 U6.6(VDD/VDDA) U7.6(VDD/VDDA) U8.6(VDD/VDDA) U9.6(VDD/VDDA) U10.2(Vout)
+10V: C40.2 C97.1 C98.1 C102.1 C103.1 C107.1 C108.1 C109.1 C113.1 C114.1 C115.1 C119.1 C120.1 C159.1 C161.1 D14.2 D15.2 D16.2 D17.2 D18.2 D19.2 D20.2 D21.2 D22.2 D23.2 D24.2 D25.2 L1.2 R68.2 U2.4(VCC) U3.4(VCC) U4.4(VCC) U5.4(VCC) U10.3(Vin)
GND: C40.1 C41.1 C42.2 C43.2 C44.2 C45.2 C46.2 C47.1 C48.1 C49.1 C50.1 C51.1 C52.2 C53.2 C54.2 C55.2 C56.2 C57.1 C58.1 C59.1 C60.1 C61.1 C97.2 C98.2 C102.2 C103.2 C107.2 C108.2 C109.2 C113.2 C114.2 C115.2 C119.2 C120.2 C121.1 C122.1 C123.1 C124.2 C125.2 C126.2 C127.1 C128.1 C129.1 C130.2 C131.2 C132.2 C133.1 C134.1 C135.1 C136.2 C137.2 C138.2 C139.1 C140.1 C141.1 C142.2 C143.2 C144.2 C145.2 C146.2 C147.2 C148.2 C149.2 C150.2 C151.2 C152.2 C153.2 C154.2 C155.2 C156.2 C157.2 C160.2 C161.2 C165.1 C166.1 C167.1 C171.1 C172.1 C173.1 C177.1 C178.1 C179.1 C183.1 C184.1 C185.1 C186.2 C187.2 C188.2 C189.2 Q28.1(S) Q28.2(S) Q28.3(S) Q29.1(S) Q29.2(S) Q29.3(S) Q30.1(S) Q30.2(S) Q30.3(S) Q34.1(S) Q34.2(S) Q34.3(S) Q35.1(S) Q35.2(S) Q35.3(S) Q36.1(S) Q36.2(S) Q36.3(S) Q40.1(S) Q40.2(S) Q40.3(S) Q41.1(S) Q41.2(S) Q41.3(S) Q42.1(S) Q42.2(S) Q42.3(S) Q46.1(S) Q46.2(S) Q46.3(S) Q47.1(S) Q47.2(S) Q47.3(S) Q48.1(S) Q48.2(S) Q48.3(S) R35.1 R36.1 R37.1 R44.1 R45.1 R46.1 R53.1 R54.1 R55.1 R62.1 R63.1 R64.1 R65.1 R67.1 U1.1 U2.6(COM) U2.25(EP) U3.6(COM) U3.25(EP) U4.6(COM) U4.25(EP) U5.6(COM) U5.25(EP) U6.7(VSS/VSSA) U7.7(VSS/VSSA) U8.7(VSS/VSSA) U9.7(VSS/VSSA) U10.1(GND) U12.1(GND) U12.5(FB)
VCC: C42.1 C43.1 C44.1 C45.1 C46.1 C47.2 C48.2 C49.2 C50.2 C51.2 C52.1 C53.1 C54.1 C55.1 C56.1 C57.2 C58.2 C59.2 C60.2 C61.2 C157.1 C186.1 C187.1 C188.1 C189.1 Q25.5(D) Q26.5(D) Q27.5(D) Q31.5(D) Q32.5(D) Q33.5(D) Q37.5(D) Q38.5(D) Q39.5(D) Q43.5(D) Q44.5(D) Q45.5(D) U12.2(VIN) U12.3(EN/UVLO)
AHIGH_1: U2.22(HIN1) U6.34(PA12[PA10])
AHIGH_2: U4.22(HIN1) U8.34(PA12[PA10])
AHIGH_3: U3.22(HIN1) U7.34(PA12[PA10])
AHIGH_4: U5.22(HIN1) U9.34(PA12[PA10])
ALOW_1: U2.1(LIN1) U6.20(PB1)
ALOW_2: U4.1(LIN1) U8.20(PB1)
ALOW_3: U3.1(LIN1) U7.20(PB1)
ALOW_4: U5.1(LIN1) U9.20(PB1)
BEMF_COMMON_1: R29.2 R30.2 R31.2 U6.12(PA1)
BEMF_COMMON_2: R38.2 R39.2 R40.2 U8.12(PA1)
BEMF_COMMON_3: R47.2 R48.2 R49.2 U7.12(PA1)
BEMF_COMMON_4: R56.2 R57.2 R58.2 U9.12(PA1)
BEMFA_1: C145.1 D26.2 R29.1 R34.1 R37.2 U6.11(PA0)
BEMFA_2: C148.1 D29.2 R38.1 R43.1 R46.2 U8.11(PA0)
BEMFA_3: C151.1 D32.2 R47.1 R52.1 R55.2 U7.11(PA0)
BEMFA_4: C154.1 D35.2 R56.1 R61.1 R64.2 U9.11(PA0)
BEMFB_1: C146.1 D27.2 R30.1 R33.1 R36.2 U6.15(PA4)
BEMFB_2: C149.1 D30.2 R39.1 R42.1 R45.2 U8.15(PA4)
BEMFB_3: C152.1 D33.2 R48.1 R51.1 R54.2 U7.15(PA4)
BEMFB_4: C155.1 D36.2 R57.1 R60.1 R63.2 U9.15(PA4)
BEMFC_1: C147.1 D28.2 R31.1 R32.1 R35.2 U6.16(PA5)
BEMFC_2: C150.1 D31.2 R40.1 R41.1 R44.2 U8.16(PA5)
BEMFC_3: C153.1 D34.2 R49.1 R50.1 R53.2 U7.16(PA5)
BEMFC_4: C156.1 D37.2 R58.1 R59.1 R62.2 U9.16(PA5)
BHIGH_1: U2.23(HIN2) U6.33(PA11[PA9])
BHIGH_2: U4.23(HIN2) U8.33(PA11[PA9])
BHIGH_3: U3.23(HIN2) U7.33(PA11[PA9])
BHIGH_4: U5.23(HIN2) U9.33(PA11[PA9])
BLOW_1: U2.2(LIN2) U6.19(PB0)
BLOW_2: U4.2(LIN2) U8.19(PB0)
BLOW_3: U3.2(LIN2) U7.19(PB0)
BLOW_4: U5.2(LIN2) U9.19(PB0)
CHIGH_1: U2.24(HIN3) U6.28(PA8)
CHIGH_2: U4.24(HIN3) U8.28(PA8)
CHIGH_3: U3.24(HIN3) U7.28(PA8)
CHIGH_4: U5.24(HIN3) U9.28(PA8)
CLOW_1: U2.3(LIN3) U6.18(PA7)
CLOW_2: U4.3(LIN3) U8.18(PA7)
CLOW_3: U3.3(LIN3) U7.18(PA7)
CLOW_4: U5.3(LIN3) U9.18(PA7)
GHA_1: R71.1 U2.19(HO1)
GHA_2: R83.1 U4.19(HO1)
GHA_3: R77.1 U3.19(HO1)
GHA_4: R89.1 U5.19(HO1)
GHB_1: R70.1 U2.16(HO2)
GHB_2: R82.1 U4.16(HO2)
GHB_3: R76.1 U3.16(HO2)
GHB_4: R88.1 U5.16(HO2)
GHC_1: R69.1 U2.13(HO3)
GHC_2: R81.1 U4.13(HO3)
GHC_3: R75.1 U3.13(HO3)
GHC_4: R87.1 U5.13(HO3)
GLA_1: R72.1 U2.11(LO1)
GLA_2: R84.1 U4.11(LO1)
GLA_3: R78.1 U3.11(LO1)
GLA_4: R90.1 U5.11(LO1)
GLB_1: R73.1 U2.10(LO2)
GLB_2: R85.1 U4.10(LO2)
GLB_3: R79.1 U3.10(LO2)
GLB_4: R91.1 U5.10(LO2)
GLC_1: R74.1 U2.9(LO3)
GLC_2: R86.1 U4.9(LO3)
GLC_3: R80.1 U3.9(LO3)
GLC_4: R92.1 U5.9(LO3)
MOTORA_1: C101.2 C164.2 Q27.1(S) Q27.2(S) Q27.3(S) Q30.5(D) R34.2 U2.18(VS1)
MOTORA_2: C112.2 C176.2 Q39.1(S) Q39.2(S) Q39.3(S) Q42.5(D) R43.2 U4.18(VS1)
MOTORA_3: C106.2 C170.2 Q33.1(S) Q33.2(S) Q33.3(S) Q36.5(D) R52.2 U3.18(VS1)
MOTORA_4: C118.2 C182.2 Q45.1(S) Q45.2(S) Q45.3(S) Q48.5(D) R61.2 U5.18(VS1)
MOTORB_1: C100.2 C163.2 Q26.1(S) Q26.2(S) Q26.3(S) Q29.5(D) R33.2 U2.15(VS2)
MOTORB_2: C111.2 C175.2 Q38.1(S) Q38.2(S) Q38.3(S) Q41.5(D) R42.2 U4.15(VS2)
MOTORB_3: C105.2 C169.2 Q32.1(S) Q32.2(S) Q32.3(S) Q35.5(D) R51.2 U3.15(VS2)
MOTORB_4: C117.2 C181.2 Q44.1(S) Q44.2(S) Q44.3(S) Q47.5(D) R60.2 U5.15(VS2)
MOTORC_1: C99.2 C162.2 Q25.1(S) Q25.2(S) Q25.3(S) Q28.5(D) R32.2 U2.12(VS3)
MOTORC_2: C110.2 C174.2 Q37.1(S) Q37.2(S) Q37.3(S) Q40.5(D) R41.2 U4.12(VS3)
MOTORC_3: C104.2 C168.2 Q31.1(S) Q31.2(S) Q31.3(S) Q34.5(D) R50.2 U3.12(VS3)
MOTORC_4: C116.2 C180.2 Q43.1(S) Q43.2(S) Q43.3(S) Q46.5(D) R59.2 U5.12(VS3)
S-INPUT_1: R25.1 U1.5
S-INPUT_2: R27.1 U1.6
S-INPUT_3: R26.1 U1.7
S-INPUT_4: R28.1 U1.8
SWDCLK_1: U6.36(PA14-BOOT0)
SWDCLK_2: U8.36(PA14-BOOT0)
SWDCLK_3: U7.36(PA14-BOOT0)
SWDCLK_4: U9.36(PA14-BOOT0)
SWDIO_1: U6.35(PA13)
SWDIO_2: U8.35(PA13)
SWDIO_3: U7.35(PA13)
SWDIO_4: U9.35(PA13)
Net-(C99-1): C99.1 D14.1 U2.14(VB3)
Net-(C100-1): C100.1 D15.1 U2.17(VB2)
Net-(C101-1): C101.1 D16.1 U2.20(VB1)
Net-(C104-1): C104.1 D17.1 U3.14(VB3)
Net-(C105-1): C105.1 D18.1 U3.17(VB2)
Net-(C106-1): C106.1 D19.1 U3.20(VB1)
Net-(C110-1): C110.1 D20.1 U4.14(VB3)
Net-(C111-1): C111.1 D21.1 U4.17(VB2)
Net-(C112-1): C112.1 D22.1 U4.20(VB1)
Net-(C116-1): C116.1 D23.1 U5.14(VB3)
Net-(C117-1): C117.1 D24.1 U5.17(VB2)
Net-(C118-1): C118.1 D25.1 U5.20(VB1)
Net-(C124-1): C124.1 U6.10(PF2-NRST)
Net-(C125-1): C125.1 C126.1 U6.5(VREF+)
Net-(C130-1): C130.1 U7.10(PF2-NRST)
Net-(C131-1): C131.1 C132.1 U7.5(VREF+)
Net-(C136-1): C136.1 U8.10(PF2-NRST)
Net-(C137-1): C137.1 C138.1 U8.5(VREF+)
Net-(C142-1): C142.1 U9.10(PF2-NRST)
Net-(C143-1): C143.1 C144.1 U9.5(VREF+)
Net-(C158-1): C158.1 L1.1 R66.1 U12.8(SW)
Net-(C158-2): C158.2 U12.7(BST)
Net-(C159-2): C159.2 C160.1 R66.2
Net-(C162-1): C162.1 Q25.4(G) R69.2
Net-(C163-1): C163.1 Q26.4(G) R70.2
Net-(C164-1): C164.1 Q27.4(G) R71.2
Net-(C165-2): C165.2 Q28.4(G) R74.2
Net-(C166-2): C166.2 Q29.4(G) R73.2
Net-(C167-2): C167.2 Q30.4(G) R72.2
Net-(C168-1): C168.1 Q31.4(G) R75.2
Net-(C169-1): C169.1 Q32.4(G) R76.2
Net-(C170-1): C170.1 Q33.4(G) R77.2
Net-(C171-2): C171.2 Q34.4(G) R80.2
Net-(C172-2): C172.2 Q35.4(G) R79.2
Net-(C173-2): C173.2 Q36.4(G) R78.2
Net-(C174-1): C174.1 Q37.4(G) R81.2
Net-(C175-1): C175.1 Q38.4(G) R82.2
Net-(C176-1): C176.1 Q39.4(G) R83.2
Net-(C177-2): C177.2 Q40.4(G) R86.2
Net-(C178-2): C178.2 Q41.4(G) R85.2
Net-(C179-2): C179.2 Q42.4(G) R84.2
Net-(C180-1): C180.1 Q43.4(G) R87.2
Net-(C181-1): C181.1 Q44.4(G) R88.2
Net-(C182-1): C182.1 Q45.4(G) R89.2
Net-(C183-2): C183.2 Q46.4(G) R92.2
Net-(C184-2): C184.2 Q47.4(G) R91.2
Net-(C185-2): C185.2 Q48.4(G) R90.2
Net-(R25-2): R25.2 U6.13(PA2)
Net-(R26-2): R26.2 U7.13(PA2)
Net-(R27-2): R27.2 U8.13(PA2)
Net-(R28-2): R28.2 U9.13(PA2)
Net-(R65-2): R65.2 U12.4(RON)
Net-(R67-2): R67.2 R68.1

Not connected (* = marked no-connect by the designer): U1 3 4; U2 5(NC)* 7(NC)* 8(NC)* 21(NC)*; U3 5(NC)* 7(NC)* 8(NC)* 21(NC)*; U4 5(NC)* 7(NC)* 8(NC)* 21(NC)*; U5 5(NC)* 7(NC)* 8(NC)* 21(NC)*; U6 1(PC13)* 2(PC14-OSC32_IN)* 3(PC15-OSC32_OUT)* 4(VBAT)* 8(PF0-OSC_IN)* 9(PF1-OSC_OUT)* 14(PA3)* 17(PA6)* 21(PB2)* 22(PB10)* 23(PB11)* 24(PB12)* 25(PB13)* 26(PB14)* 27(PB15)* 29(PA9)* 30(PC6)* 31(PC7)* 32(PA10)* 37(PA15)* 38(PD0)* 39(PD1)* 40(PD2)* 41(PD3)* 42(PB3)* 43(PB4)* 44(PB5)* 45(PB6)* 46(PB7)* 47(PB8)* 48(PB9)*; U7 1(PC13)* 2(PC14-OSC32_IN)* 3(PC15-OSC32_OUT)* 4(VBAT)* 8(PF0-OSC_IN)* 9(PF1-OSC_OUT)* 14(PA3)* 17(PA6)* 21(PB2)* 22(PB10)* 23(PB11)* 24(PB12)* 25(PB13)* 26(PB14)* 27(PB15)* 29(PA9)* 30(PC6)* 31(PC7)* 32(PA10)* 37(PA15)* 38(PD0)* 39(PD1)* 40(PD2)* 41(PD3)* 42(PB3)* 43(PB4)* 44(PB5)* 45(PB6)* 46(PB7)* 47(PB8)* 48(PB9)*; U8 1(PC13)* 2(PC14-OSC32_IN)* 3(PC15-OSC32_OUT)* 4(VBAT)* 8(PF0-OSC_IN)* 9(PF1-OSC_OUT)* 14(PA3)* 17(PA6)* 21(PB2)* 22(PB10)* 23(PB11)* 24(PB12)* 25(PB13)* 26(PB14)* 27(PB15)* 29(PA9)* 30(PC6)* 31(PC7)* 32(PA10)* 37(PA15)* 38(PD0)* 39(PD1)* 40(PD2)* 41(PD3)* 42(PB3)* 43(PB4)* 44(PB5)* 45(PB6)* 46(PB7)* 47(PB8)* 48(PB9)*; U9 1(PC13)* 2(PC14-OSC32_IN)* 3(PC15-OSC32_OUT)* 4(VBAT)* 8(PF0-OSC_IN)* 9(PF1-OSC_OUT)* 14(PA3)* 17(PA6)* 21(PB2)* 22(PB10)* 23(PB11)* 24(PB12)* 25(PB13)* 26(PB14)* 27(PB15)* 29(PA9)* 30(PC6)* 31(PC7)* 32(PA10)* 37(PA15)* 38(PD0)* 39(PD1)* 40(PD2)* 41(PD3)* 42(PB3)* 43(PB4)* 44(PB5)* 45(PB6)* 46(PB7)* 47(PB8)* 48(PB9)*; U12 6(PGOOD)* 9(EP)*

## Notes on the sheets
sheet 3
- POWER
